# EAGLE design Zerocopter (EAGLE 9.6.2)
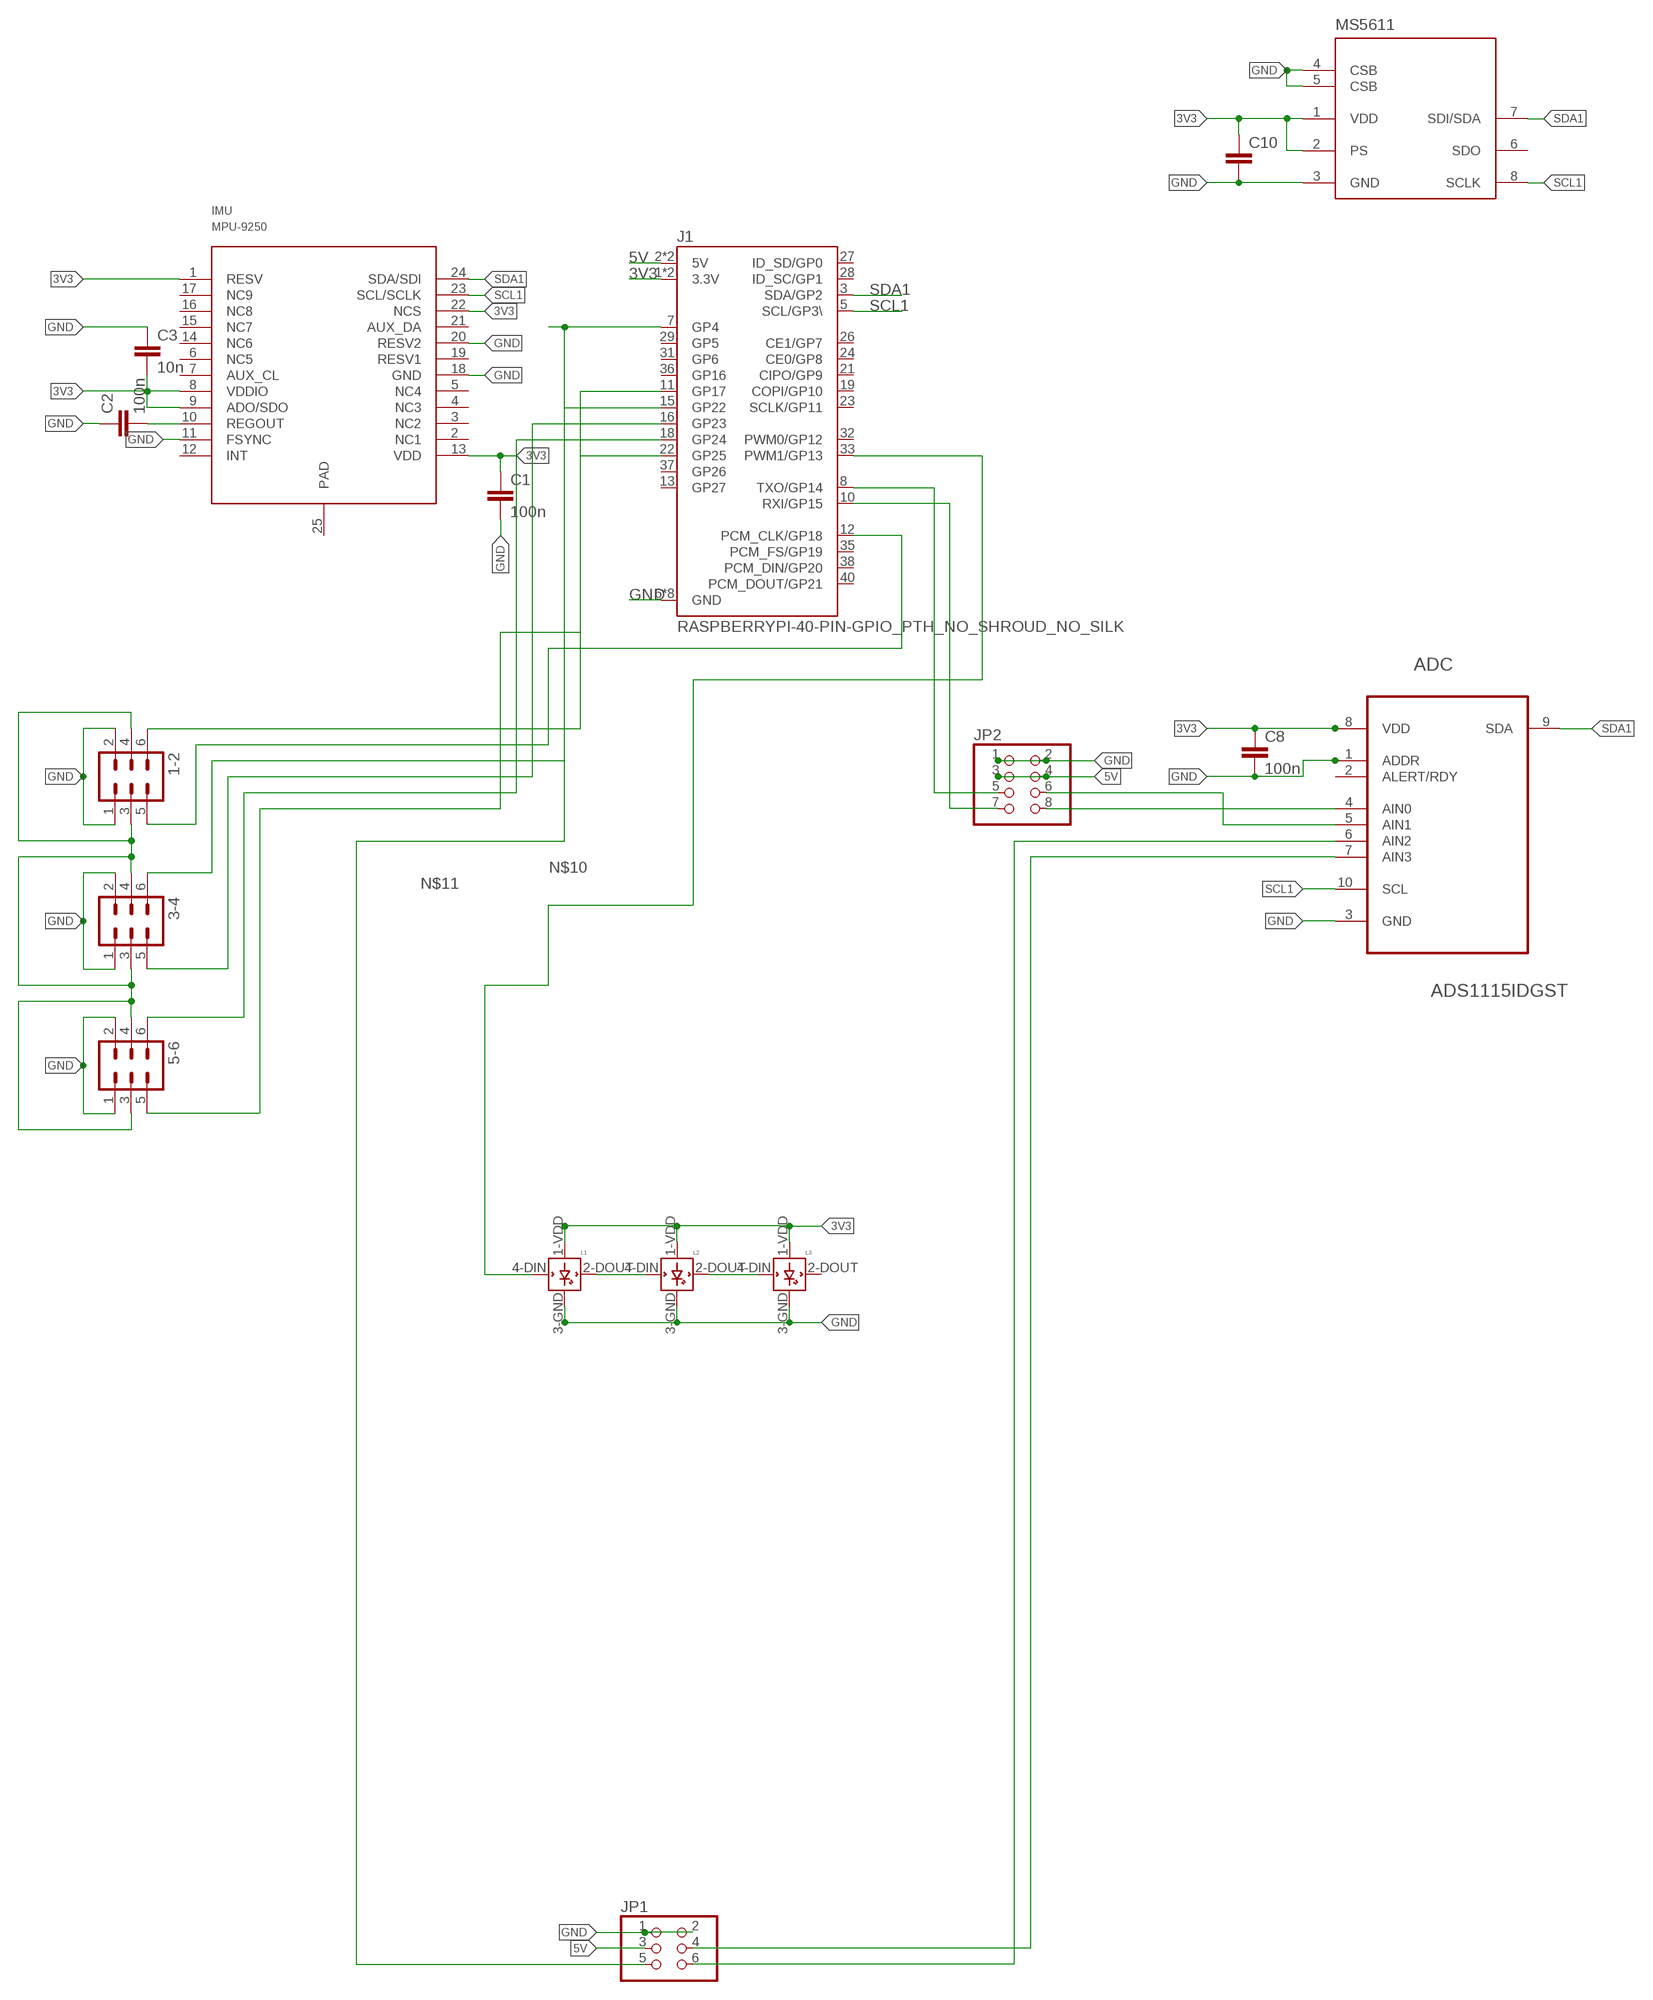
[diagram p0: schematic, sheet 1]

## Parts
1-2  MA03-2  [MA03-2]
3-4  MA03-2  [MA03-2]
5-6  MA03-2  [MA03-2]
ADC  ADS1115IDGST  [SOP50P490X110-10N]
C1  100n  C-EUC0603  [C0603]
C2  100n  C-EUC0603  [C0603]
C3  10n  C-EUC0603  [C0603]
C8  100n  C-EUC0603  [C0603]
C10  C-EUC0603  [C0603]
IMU  MPU-9250  [LEAD-QFN24]
J1  RASPBERRYPI-40-PIN-GPIO_PTH_NO_SHROUD_NO_SILK  [2X20_NOSILK]
JP1  PINHD-2X3  [2X03]
JP2  PINHD-2X4  [2X04]
L1  WS2812B  [WS2812B]
L2  WS2812B  [WS2812B]
L3  WS2812B  [WS2812B]
MS5611  MS5611-01BA03  [SON125P300X500X100-8N]

## Nets
3V3: ADC.8(VDD) C1.1 C3.2 C8.1 C10.1 IMU.1(RESV) IMU.8(VDDIO) IMU.9(ADO/SDO) IMU.13(VDD) IMU.22(NCS) J1.1(3.3V) J1.17(3.3V) L1.1-VDD(VDD) L2.1-VDD(VDD) L3.1-VDD(VDD) MS5611.1(VDD) MS5611.2(PS)
5V: J1.2(5V) J1.4(5V) JP1.3 JP2.3 JP2.4
GND: 1-2.1 1-2.2 3-4.1 3-4.2 5-6.1 5-6.2 ADC.1(ADDR) ADC.3(GND) C1.2 C2.1 C3.1 C8.2 C10.2 IMU.11(FSYNC) IMU.18(GND) IMU.20(RESV2) J1.6(GND) J1.9(GND) J1.14(GND) J1.20(GND) J1.25(GND) J1.30(GND) J1.34(GND) J1.39(GND) JP1.1 JP1.2 JP2.1 JP2.2 L1.3-GND(GND) L2.3-GND(GND) L3.3-GND(GND) MS5611.3(GND) MS5611.4(CSB) MS5611.5(CSB)
N$1: C2.2 IMU.10(REGOUT)
N$2: J1.8(TXO/GP14) JP2.5
N$3: L1.2-DOUT(DOUT) L2.4-DIN(DIN)
N$4: L2.2-DOUT(DOUT) L3.4-DIN(DIN)
N$6: ADC.6(AIN2) JP1.6
N$7: ADC.7(AIN3) JP1.4
N$8: 1-2.6 J1.11(GP17)
N$9: 1-2.5 J1.12(PCM_CLK/GP18)
N$10: J1.33(PWM1/GP13) L1.4-DIN(DIN)
N$11: J1.7(GP4) JP1.5
N$12: ADC.5(AIN1) JP2.6
N$13: 3-4.6 J1.15(GP22)
N$14: 3-4.5 J1.16(GP23)
N$15: 5-6.6 J1.18(GP24)
N$16: 5-6.5 J1.22(GP25)
N$21: ADC.4(AIN0) JP2.8
N$24: J1.10(RXI/GP15) JP2.7
N$28: 1-2.3 1-2.4 3-4.3 3-4.4 5-6.3 5-6.4
SCL1: ADC.10(SCL) IMU.23(SCL/SCLK) J1.5(SCL/GP3\) MS5611.8(SCLK)
SDA1: ADC.9(SDA) IMU.24(SDA/SDI) J1.3(SDA/GP2) MS5611.7(SDI/SDA)
Unconnected: ADC.2(ALERT/RDY) IMU.2(NC1) IMU.3(NC2) IMU.4(NC3) IMU.5(NC4) IMU.6(NC5) IMU.7(AUX_CL) IMU.12(INT) IMU.14(NC6) IMU.15(NC7) IMU.16(NC8) IMU.17(NC9) IMU.19(RESV1) IMU.21(AUX_DA) IMU.25(PAD) J1.13(GP27) J1.19(COPI/GP10) J1.21(CIPO/GP9) J1.23(SCLK/GP11) J1.24(CE0/GP8) J1.26(CE1/GP7) J1.27(ID_SD/GP0) J1.28(ID_SC/GP1) J1.29(GP5) J1.31(GP6) J1.32(PWM0/GP12) J1.35(PCM_FS/GP19) J1.36(GP16) J1.37(GP26) J1.38(PCM_DIN/GP20) J1.40(PCM_DOUT/GP21) L3.2-DOUT(DOUT) MS5611.6(SDO)

## Library data of the parts
1-2 3-4 5-6 = con-lstb:MA03-2: PIN HEADER; OC_FARNELL: unknown; OC_NEWARK: unknown
ADC = Texas Instruments_By_element14_Batch_1:ADS1115IDGST: Analog-to-Digital Converter with Internal Reference; MPN: ADS1115IDGST; OC_FARNELL: 1762981; OC_NEWARK: 25R1241; PACKAGE: MSOP-10; SUPPLIER: Texas Instruments
C1-C3 C8 C10 = resistor:C-EU: CAPACITOR, European symbol
IMU = invensense:MPU-9250
J1 = SparkFun-Connectors:RASPBERRYPI-40-PIN-GPIO: Raspberry Pi GPIO Header 2x20 pin connector, as found on B, B+, A+ models. Both shrouded PTH and SMT versions available. SparkFun Products: GPIO Shrouded Header <https://www.sparkfun.com/products/13054>- PTH SparkFun Pi Wedge (Preassembled) <https://www.sparkfun.com/products/13717>
JP1 = pinhead:PINHD-2X3: PIN HEADER
JP2 = pinhead:PINHD-2X4: PIN HEADER
L1-L3 = adafruit:WS2812B
MS5611 = Measurement-Specialties:MS5611-01BA03: Variometer Module, with stainless steel cap

## Board
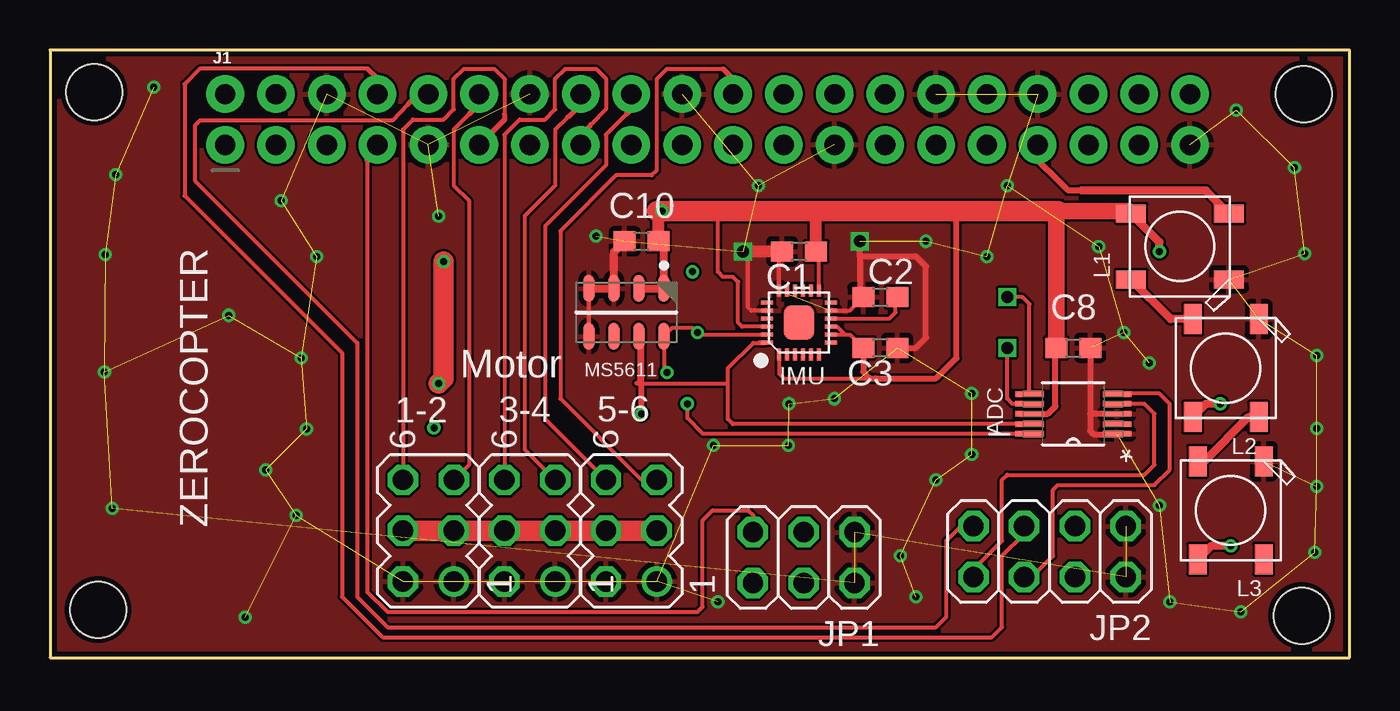
[diagram p1: board, top side]
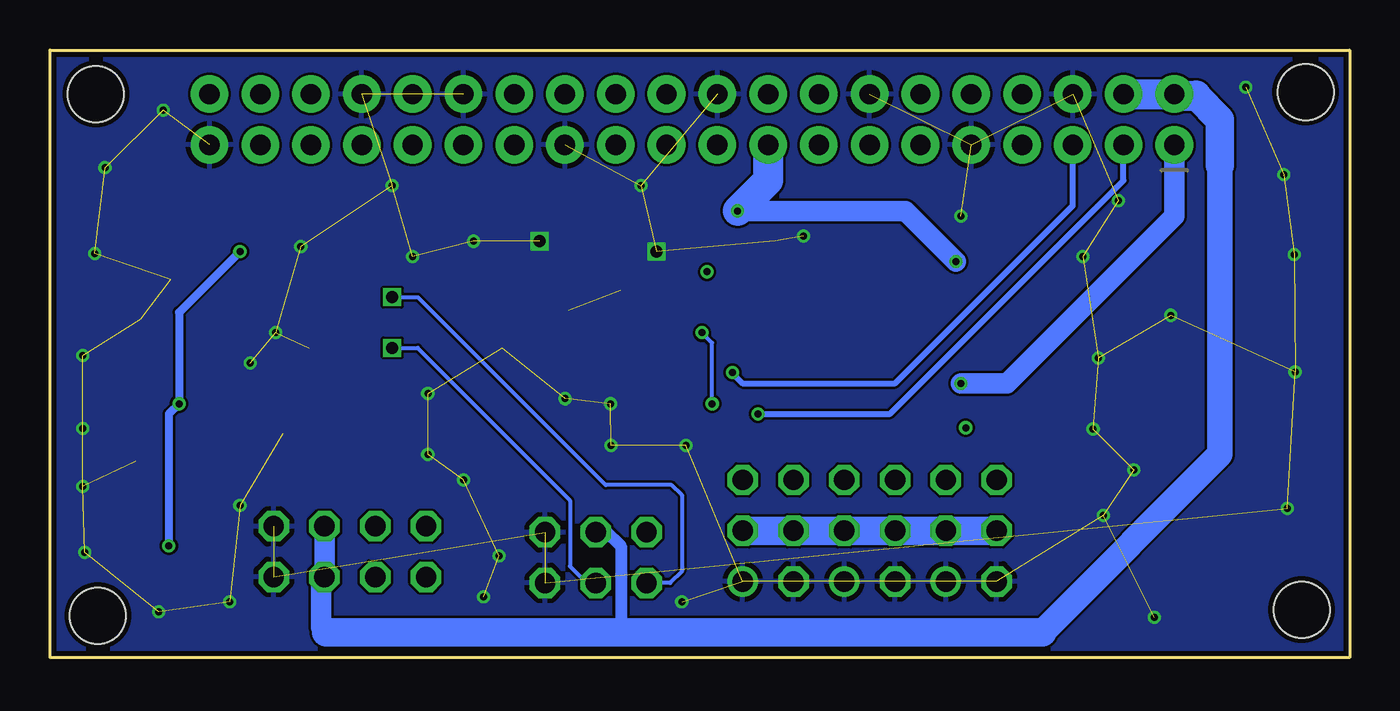
[diagram p2: board, bottom side, seen from below]

Size 65 x 30.4 mm. Coordinates in mm from the lower left corner, seen from the top.
Outline: 0,30.4 0,0 65,0 65,30.4 0,30.4
Copper layers (1*16): Top 0.035mm / dielectric 1.5mm / Bottom 0.035mm
Design rules "dirt_cheap_dirty_boards.v1": minimum track width 5mil, minimum drill 12mil, track to track 5mil, track to pad 5mil, pad to pad 5mil, via to via 5mil, smd to smd 0mil, copper to edge 10mil, drill to drill 10mil, minimum pad ring 10mil, minimum via ring 6mil, stop-mask expansion 2mil, vias tented up to drill 25mil, thermal gap 10mil
Holes 2.8 mm at 2.2,28.3 62.7,28.2 62.6,2.1 2.4,2.4

### Footprints (pad centres in the part's own frame; a part is rotated, then mirrored left to right if it is on the bottom)
MA03-2 = drill 1.016: 1 -2.54,-1.27 | drill 1.016 octagon: 2 -2.54,1.27; 3 0,-1.27; 4 0,1.27; 5 2.54,-1.27; 6 2.54,1.27
SOP50P490X110-10N = smd 1.422 x 0.279: 1 -2.184,0.991; 2 -2.184,0.508; 3 -2.184,0; 4 -2.184,-0.508; 5 -2.184,-0.991; 6 2.184,-0.991; 7 2.184,-0.508; 8 2.184,0; 9 2.184,0.508; 10 2.184,0.991
C0603 = smd 1.1 x 1: 1 -0.85,0; 2 0.85,0
LEAD-QFN24 = smd 0.6 x 0.2: 1 -1.6,1; 2 -1.6,0.6; 3 -1.6,0.2; 4 -1.6,-0.2; 5 -1.6,-0.6; 6 -1.6,-1; 13 1.6,-1; 14 1.6,-0.6; 15 1.6,-0.2; 16 1.6,0.2; 17 1.6,0.6; 18 1.6,1 | smd 0.2 x 0.6: 7 -1,-1.6; 8 -0.6,-1.6; 9 -0.2,-1.6; 10 0.2,-1.6; 11 0.6,-1.6; 12 1,-1.6; 19 1,1.6; 20 0.6,1.6; 21 0.2,1.6; 22 -0.2,1.6; 23 -0.6,1.6; 24 -1,1.6 | smd 1.7 x 1.54: 25 0,0
2X20_NOSILK = drill 1.016 pad 1.88: 1 0,0; 2 0,2.54; 3 2.54,0; 4 2.54,2.54; 5 5.08,0; 6 5.08,2.54; 7 7.62,0; 8 7.62,2.54; 9 10.16,0; 10 10.16,2.54; 11 12.7,0; 12 12.7,2.54; 13 15.24,0; 14 15.24,2.54; 15 17.78,0; 16 17.78,2.54; 17 20.32,0; 18 20.32,2.54; 19 22.86,0; 20 22.86,2.54; 21 25.4,0; 22 25.4,2.54; 23 27.94,0; 24 27.94,2.54; 25 30.48,0; 26 30.48,2.54; 27 33.02,0; 28 33.02,2.54; 29 35.56,0; 30 35.56,2.54; 31 38.1,0; 32 38.1,2.54; 33 40.64,0; 34 40.64,2.54; 35 43.18,0; 36 43.18,2.54; 37 45.72,0; 38 45.72,2.54; 39 48.26,0; 40 48.26,2.54
2X03 = drill 1.016 octagon: 1 -2.54,-1.27; 2 -2.54,1.27; 3 0,-1.27; 4 0,1.27; 5 2.54,-1.27; 6 2.54,1.27
2X04 = drill 1.016 octagon: 1 -3.81,-1.27; 2 -3.81,1.27; 3 -1.27,-1.27; 4 -1.27,1.27; 5 1.27,-1.27; 6 1.27,1.27; 7 3.81,-1.27; 8 3.81,1.27
WS2812B = smd 1.5 x 0.9: 1-VDD 2.45,-1.65; 2-DOUT 2.45,1.65; 3-GND -2.45,1.65; 4-DIN -2.45,-1.65
SON125P300X500X100-8N = smd 1.35 x 0.55: 1 -1.2,1.875; 2 -1.2,0.625; 3 -1.2,-0.625; 4 -1.2,-1.875; 5 1.2,-1.875; 6 1.2,-0.625; 7 1.2,0.625; 8 1.2,1.875

### Placement (x,y rotation side)
1-2  18.92,6.35 90 top
3-4  24,6.35 90 top
5-6  29.08,6.35 90 top
ADC  51.18,12.19 180 top
C1  37.46,20.32 180 top
C2  41.53,18.03 0 top
C3  41.53,15.49 180 top
C8  51.18,15.49 0 top
C10  29.59,20.83 180 top
IMU  37.46,16.76 90 top
J1  8.76,25.65 0 top
JP1  37.7,5 180 top
JP2  50,5.3 180 top
L1  56.51,20.57 180 top
L2  58.8,14.48 270 top
L3  59.05,7.36 270 top
MS5611  28.83,17.27 270 top

### Tracks (layer width: path | path; a pad name or v marks a point on that pad's centre or on a via)
3V3  (via drill 0.35)
  Top 0.203: IMU.13 38.46,20.17 C1.1 | IMU.8 39.75,16.16 | 39.75,16.16 40.01,16.16 C3.2 | IMU.22 34.62,16.56 34.42,16.76 34.42,18.79 34.16,19.05 33.65,19.05 33.4,19.3 33.4,22.35 | 40.68,22.69 40.77,22.35 | IMU.1 36.46,14.21 36.7,13.97 41.27,13.97 | IMU.9 39.35,16.56 39.75,16.16
  Top 0.305: C3.2 40.68,14.31 41.02,13.97 41.27,13.97 44.32,13.97 45.34,14.98 45.34,22.22 45.47,22.35 | C8.1 50.29,15.45 50.29,12.57 49.91,12.19 ADC.8 48.51,12.19
  Top 0.406: C10.1 30.7,20.56 MS5611.1 MS5611.2 | v55.5,20.32 55.5,20.79 L1.1-VDD | v58.55,12.7 57.82,12.7 L2.1-VDD | v59.05,5.59 58.08,5.59 L3.1-VDD
  Top 0.61: 30.44,22.44 v30.61,22.35 | C1.1 38.31,22.52 38.23,22.35 | C10.1 30.44,22.26 30.35,22.35
  Top 0.813: C8.1 50.33,22.26 50.42,22.35 53.94,22.35 L1.1-VDD
  Top 1.016: 30.35,22.35 v30.61,22.35 33.4,22.35 38.23,22.35 40.77,22.35 45.47,22.35 50.42,22.35 | v19.68,19.81 19.68,13.97 v19.43,13.71
  Bottom 0.406: v55.5,20.32 58.55,17.27 v58.55,12.7 59.05,12.19 v59.05,5.59
  Bottom 1.016: v30.61,22.35 22.22,22.35 v19.68,19.81 | v19.43,13.71 17.14,13.71 8.76,22.1 J1.1
  Bottom 1.5: v30.61,22.35 29.07,23.89 29.08,23.9 J1.17
5V
  Bottom 0.508: JP1.3 37.29,6.27 37.21,6.35
  Bottom 0.61: 37.21,6.35 36.45,5.59 36.45,1.27
  Bottom 1.016: JP2.3 JP2.4 51.43,3.87 51.43,2.2 51.43,1.52 51.18,1.27
  Bottom 1.27: 15.37,1.27 6.48,10.16 6.48,24.64
  Bottom 1.422: 6.48,24.64 6.48,26.92 7.67,28.11 | 15.37,1.27 36.45,1.27 51.18,1.27
  Bottom 1.5: J1.4 J1.2 8.68,28.11 7.67,28.11
GND  (via drill 0.35, 0.6)  (66 unrouted)
  Top 0.203: IMU.18 36.46,20.17 C1.2 | IMU.11 40.01,17.36 C2.1 | IMU.20 35.09,17.36 34.92,17.52 34.92,20.06 v34.67,20.32 | 53.34,11.17 ADC.1 | MS5611.5 MS5611.4
  Top 0.305: C8.2 52.03,12.19 | 52.03,12.19 52.03,11.34 52.2,11.17 53.34,11.17 | ADC.3 52.03,12.19 | C3.1 43.31,15.49 43.81,16 43.81,19.56 43.31,20.06 40.51,20.06 | 40.51,20.06 40.51,18.2 C2.1 | 40.51,20.06 v40.51,20.83
  Top 0.406: C10.2 28.2,20.29 MS5611.3 MS5611.4
  Top 0.61: C1.2 v34.67,20.32
  other vias: 11.56,22.86 5.19,28.53 3.28,24.16 3.11,7.46 9.76,2.01 12.32,7.11 10.79,9.4 2.72,14.28 12.83,11.43 2.77,20.17 12.57,14.98 8.93,17.12 13.33,20.06 19.43,22.1 27.3,21.08 33.19,10.61 36.96,12.7 39.24,12.95 36.94,10.6 44.32,8.89 42.54,5.08 43.31,3.05 56.01,2.79 55.5,7.62 63.37,8.56 63.26,5.27 63.37,11.47 63.37,15.11 62.76,20.21 62.25,24.51 59.34,27.38 54.99,14.73 53.72,16.25 52.45,20.57 46.1,13.21 46.1,10.16 43.81,20.83 46.86,20.06 47.88,23.62 35.43,23.62 59.56,2.28 33.4,2.79
  pour Bottom: 0,30.4 65,30.4 65,-0.2 0,-0.2
  pour Top: 0,30.4 65.1,30.4 65.1,-0.2 0,-0.2
N$1
  Top 0.203: IMU.10 41.98,16.96 42.29,17.27 42.29,17.94 C2.2
N$2
  Top 0.203: 16.37,28.97 15.87,29.46 7.49,29.46 6.73,28.7 6.73,23.11 14.6,15.24 14.6,3.05 16.64,1.01 47.12,1.01 47.62,1.52 47.62,5.08 48.73,6.18 JP2.5
  Top 0.254: J1.8 16.38,28.95 15.87,29.46
N$3
  Top 0.406: L2.4-DIN 56.06,16.93 L1.2-DOUT
N$4
  Top 0.406: L2.2-DOUT 59.94,12.03 57.73,9.81 L3.4-DIN
N$5  (via drill 0.35)
  other vias: 19.2,11.5
N$6  (via drill 0.6)
  Top 0.203: ADC.6 49,17.68 48.64,18.03 v47.88,18.03
  Bottom 0.203: v47.88,18.03 46.61,18.03 37.21,8.63 33.91,8.63 33.4,8.13 33.4,4.32 33.99,3.73 JP1.6
N$7  (via drill 0.6)
  Top 0.203: ADC.7 48.13,12.7 47.88,12.95 v47.88,15.49
  Bottom 0.203: v47.88,15.49 46.61,15.49 38.99,7.87 38.99,4.57 38.23,3.81 37.78,3.81 JP1.4
N$8
  Top 0.203: 1-2.6 17.52,9.01 17.65,9.14 17.65,26.41 18.16,26.92 19.68,26.92 20.19,27.43 20.19,28.95 20.7,29.46 22.22,29.46 22.73,28.95 22.73,27.18 22.73,26.86
  Top 0.254: 22.73,27.18 22.73,26.92 J1.11
N$9
  Top 0.203: 20.95,27.18 20.19,26.41 20.19,23.62 20.95,22.86 20.95,9.65 1-2.5 | 21.46,27.68 21.46,28.1
  Top 0.254: J1.12 21.46,27.68 20.95,27.18
N$10
  Top 0.254: 50.93,23.37 49.4,24.89
  Top 0.305: 51.6,23.37 50.93,23.37 48.89,25.4 49.15,25.65 J1.33
  Top 0.406: L1.4-DIN 57.82,23.37 51.6,23.37
N$11
  Top 0.203: 15.87,24.9 15.87,3.3 16.89,2.28 32.38,2.28 32.64,2.54 32.64,6.86 33.15,7.36 34.92,7.36 35.18,7.11 35.18,6.29 JP1.5
  Top 0.305: J1.7 15.87,25.14 15.87,24.9
N$12
  Top 0.2: 50.42,8.63 55.24,8.63 56.01,9.4 56.01,12.7 55.5,13.21 53.39,13.21 ADC.5
  Top 0.203: 50.42,8.63 50.16,8.38 50.16,5.08 49.12,4.03 JP2.6
N$13
  Top 0.203: 27.05,26.67 27.81,27.43 27.81,28.95 27.3,29.46 25.78,29.46 25.27,28.95 25.27,27.43 24.76,26.92 23.49,26.92 22.73,26.16 3-4.6 | 26.54,26.16 26.54,25.59
  Top 0.254: J1.15 26.54,26.16 27.05,26.67
N$14
  Top 0.203: 25.91,27.05 25.27,26.41 25.27,23.62 23.75,22.1 23.75,10.41 3-4.5 | 26.54,27.68 26.54,28.1
  Top 0.254: J1.16 26.54,27.68 25.91,27.05
N$15
  Top 0.203: 28.83,27.87 28.83,27.18 27.81,26.16 27.81,24.64 24.76,21.59 24.76,11.94 5-6.6
  Top 0.254: J1.18 29.08,27.43 28.83,27.18
N$16
  Top 0.203: 5-6.5 29.59,8.89 25.53,12.95 25.53,21.33 28.32,24.13 30.1,24.13 30.35,24.38 30.35,28.95 30.86,29.46 33.65,29.46
  Top 0.254: J1.22 34.16,28.95 33.65,29.46
N$21
  Top 0.2: 54.74,9.14 55.24,9.65 55.24,12.19 54.74,12.7
  Top 0.203: 54.74,12.7 ADC.4 | 54.74,9.14 47.88,9.14 47.62,8.89 47.62,5.84 46.19,4.41 JP2.8
N$24
  Top 0.203: 18.73,27.94 18.16,27.94 17.91,27.68 17.14,26.87 7.49,26.87 7.24,26.62 7.24,23.87 15.37,15.75 15.37,3.05 16.89,1.52 44.32,1.52 44.83,2.03 44.83,5.84 45.56,6.57 JP2.7
  Top 0.254: J1.10 18.43,28.19 17.91,27.68
N$26  (via drill 0.35)
  other vias: 32.13,19.3
N$28
  Top 1.016: 5-6.3 5-6.4 3-4.3 3-4.4 1-2.3 1-2.4
  Bottom 1.422: 1-2.4 5-6.3
SCL1  (via drill 0.35)
  Top 0.203: IMU.23 32.48,16.16 v32.38,16.25 32.13,16.51 31.14,16.51 MS5611.8 30.7,14.43 v30.86,14.27 | ADC.10 32.66,11.2 31.88,11.99 v31.88,12.7
  Bottom 0.203: v31.88,12.7 31.88,15.75 v32.38,16.25 | v30.86,14.27 30.86,14.22
  Bottom 0.305: 30.86,14.22 30.35,13.71 22.73,13.71 13.84,22.6 J1.5
SDA1  (via drill 0.35)
  Top 0.203: 35.45,15.76 IMU.24 35.85,15.75 35.18,15.75 33.91,14.48 33.91,13.71 | 33.91,13.71 29.34,13.71 29.45,13.83 MS5611.7 | ADC.9 34.16,11.68 33.91,11.94 33.91,13.71
  Top 0.305: v29.59,12.19 29.59,15.93 MS5611.7
  Bottom 0.305: J1.3 11.3,23.87 22.99,12.19 v29.59,12.19

### Text on the board
tNames: Motor | ZEROCOPTER